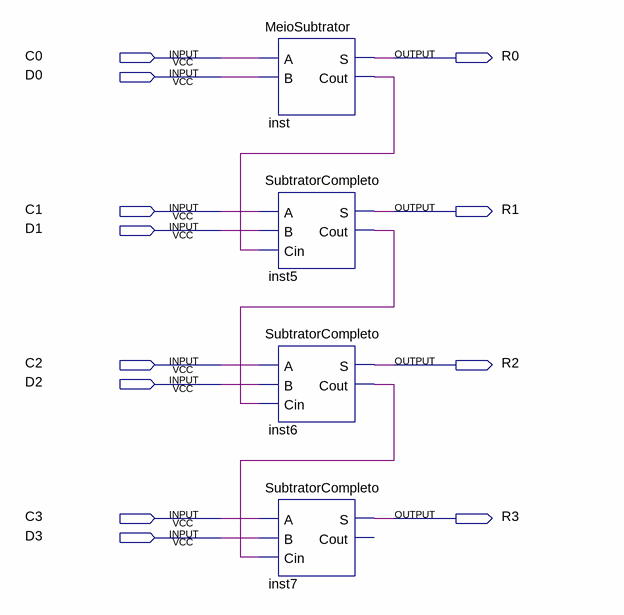
[diagram p0: schematic sheet]
// Quartus schematic Subtrator4Bits.bdf as structural Verilog: 4 symbols, 12 pins
module Subtrator4Bits (
  input  C0,
  input  D0,
  input  C1,
  input  D1,
  input  C2,
  input  D2,
  input  C3,
  input  D3,
  output R0,
  output R1,
  output R2,
  output R3
);

  wire inst5_cout, inst6_cout, inst_cout;

  MeioSubtrator inst (.A(C0), .B(D0), .S(R0), .Cout(inst_cout));
  SubtratorCompleto inst5 (.A(C1), .B(D1), .Cin(inst_cout), .S(R1), .Cout(inst5_cout));
  SubtratorCompleto inst6 (.A(C2), .B(D2), .Cin(inst5_cout), .S(R2), .Cout(inst6_cout));
  SubtratorCompleto inst7 (.A(C3), .B(D3), .Cin(inst6_cout), .S(R3));  // open: Cout
endmodule
